# Altium schematic sheet 主板.SchDoc: STM32F407 &
size 711 x 474 mm; Revision: V1.0
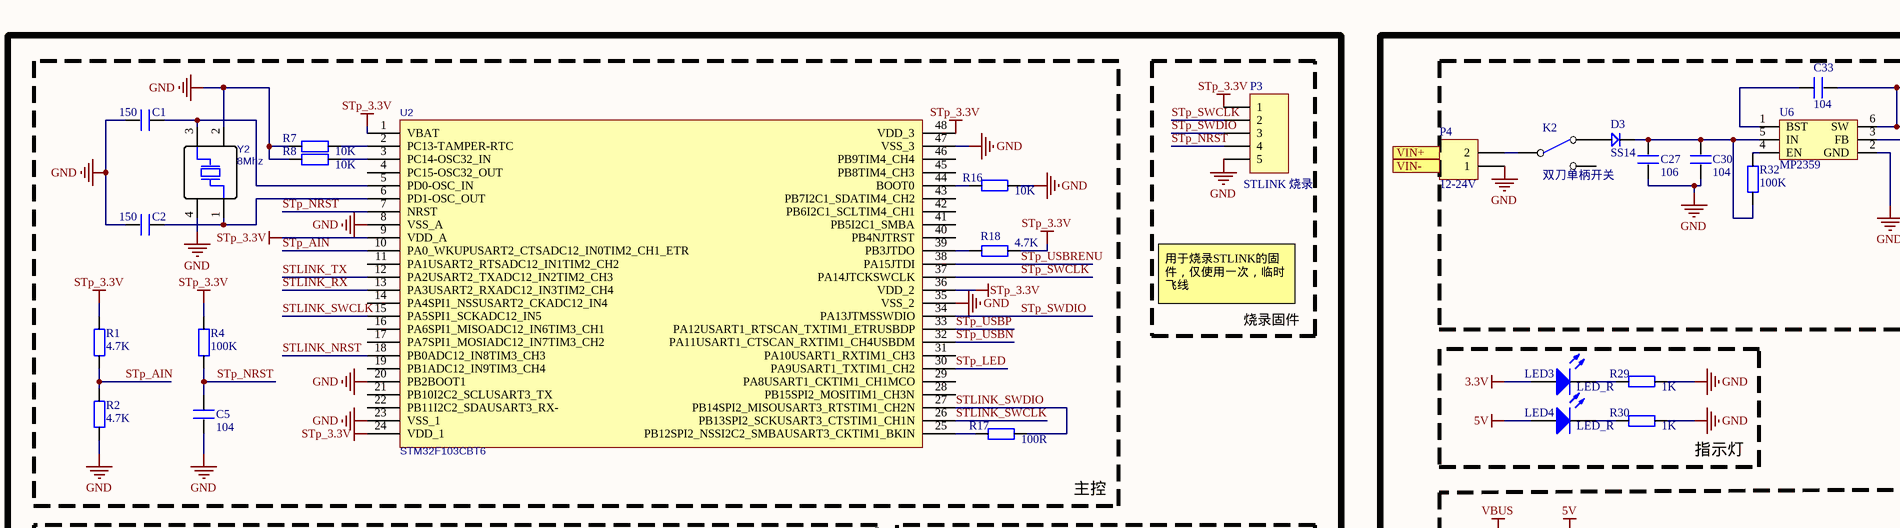
[diagram p0: 主板.SchDoc, top left]
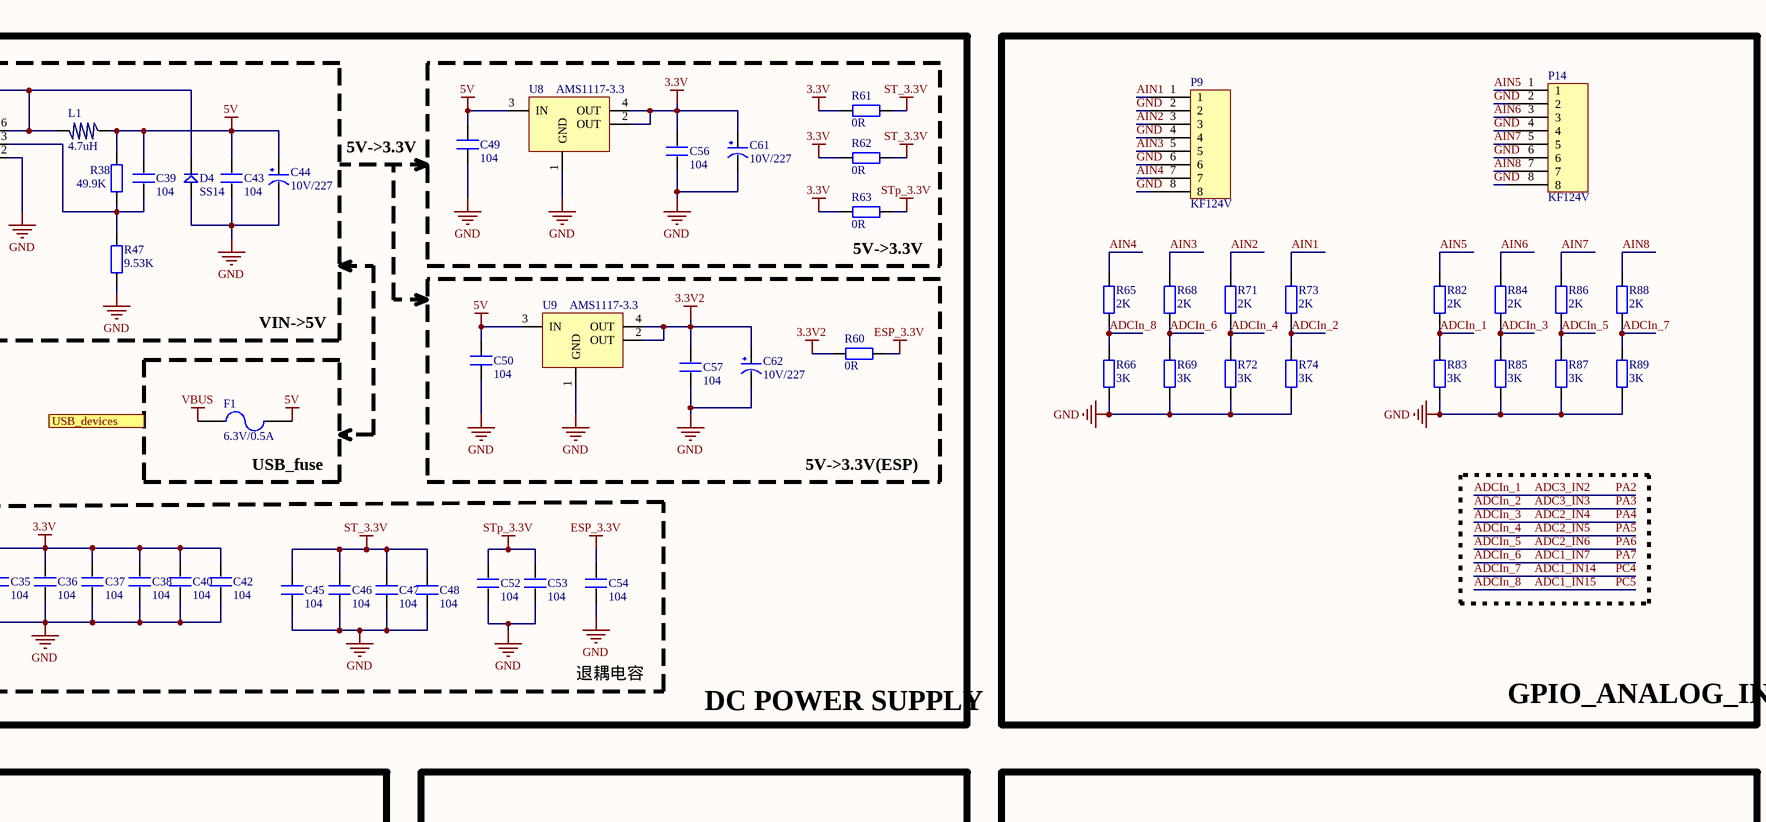
[diagram p1: 主板.SchDoc, top right]
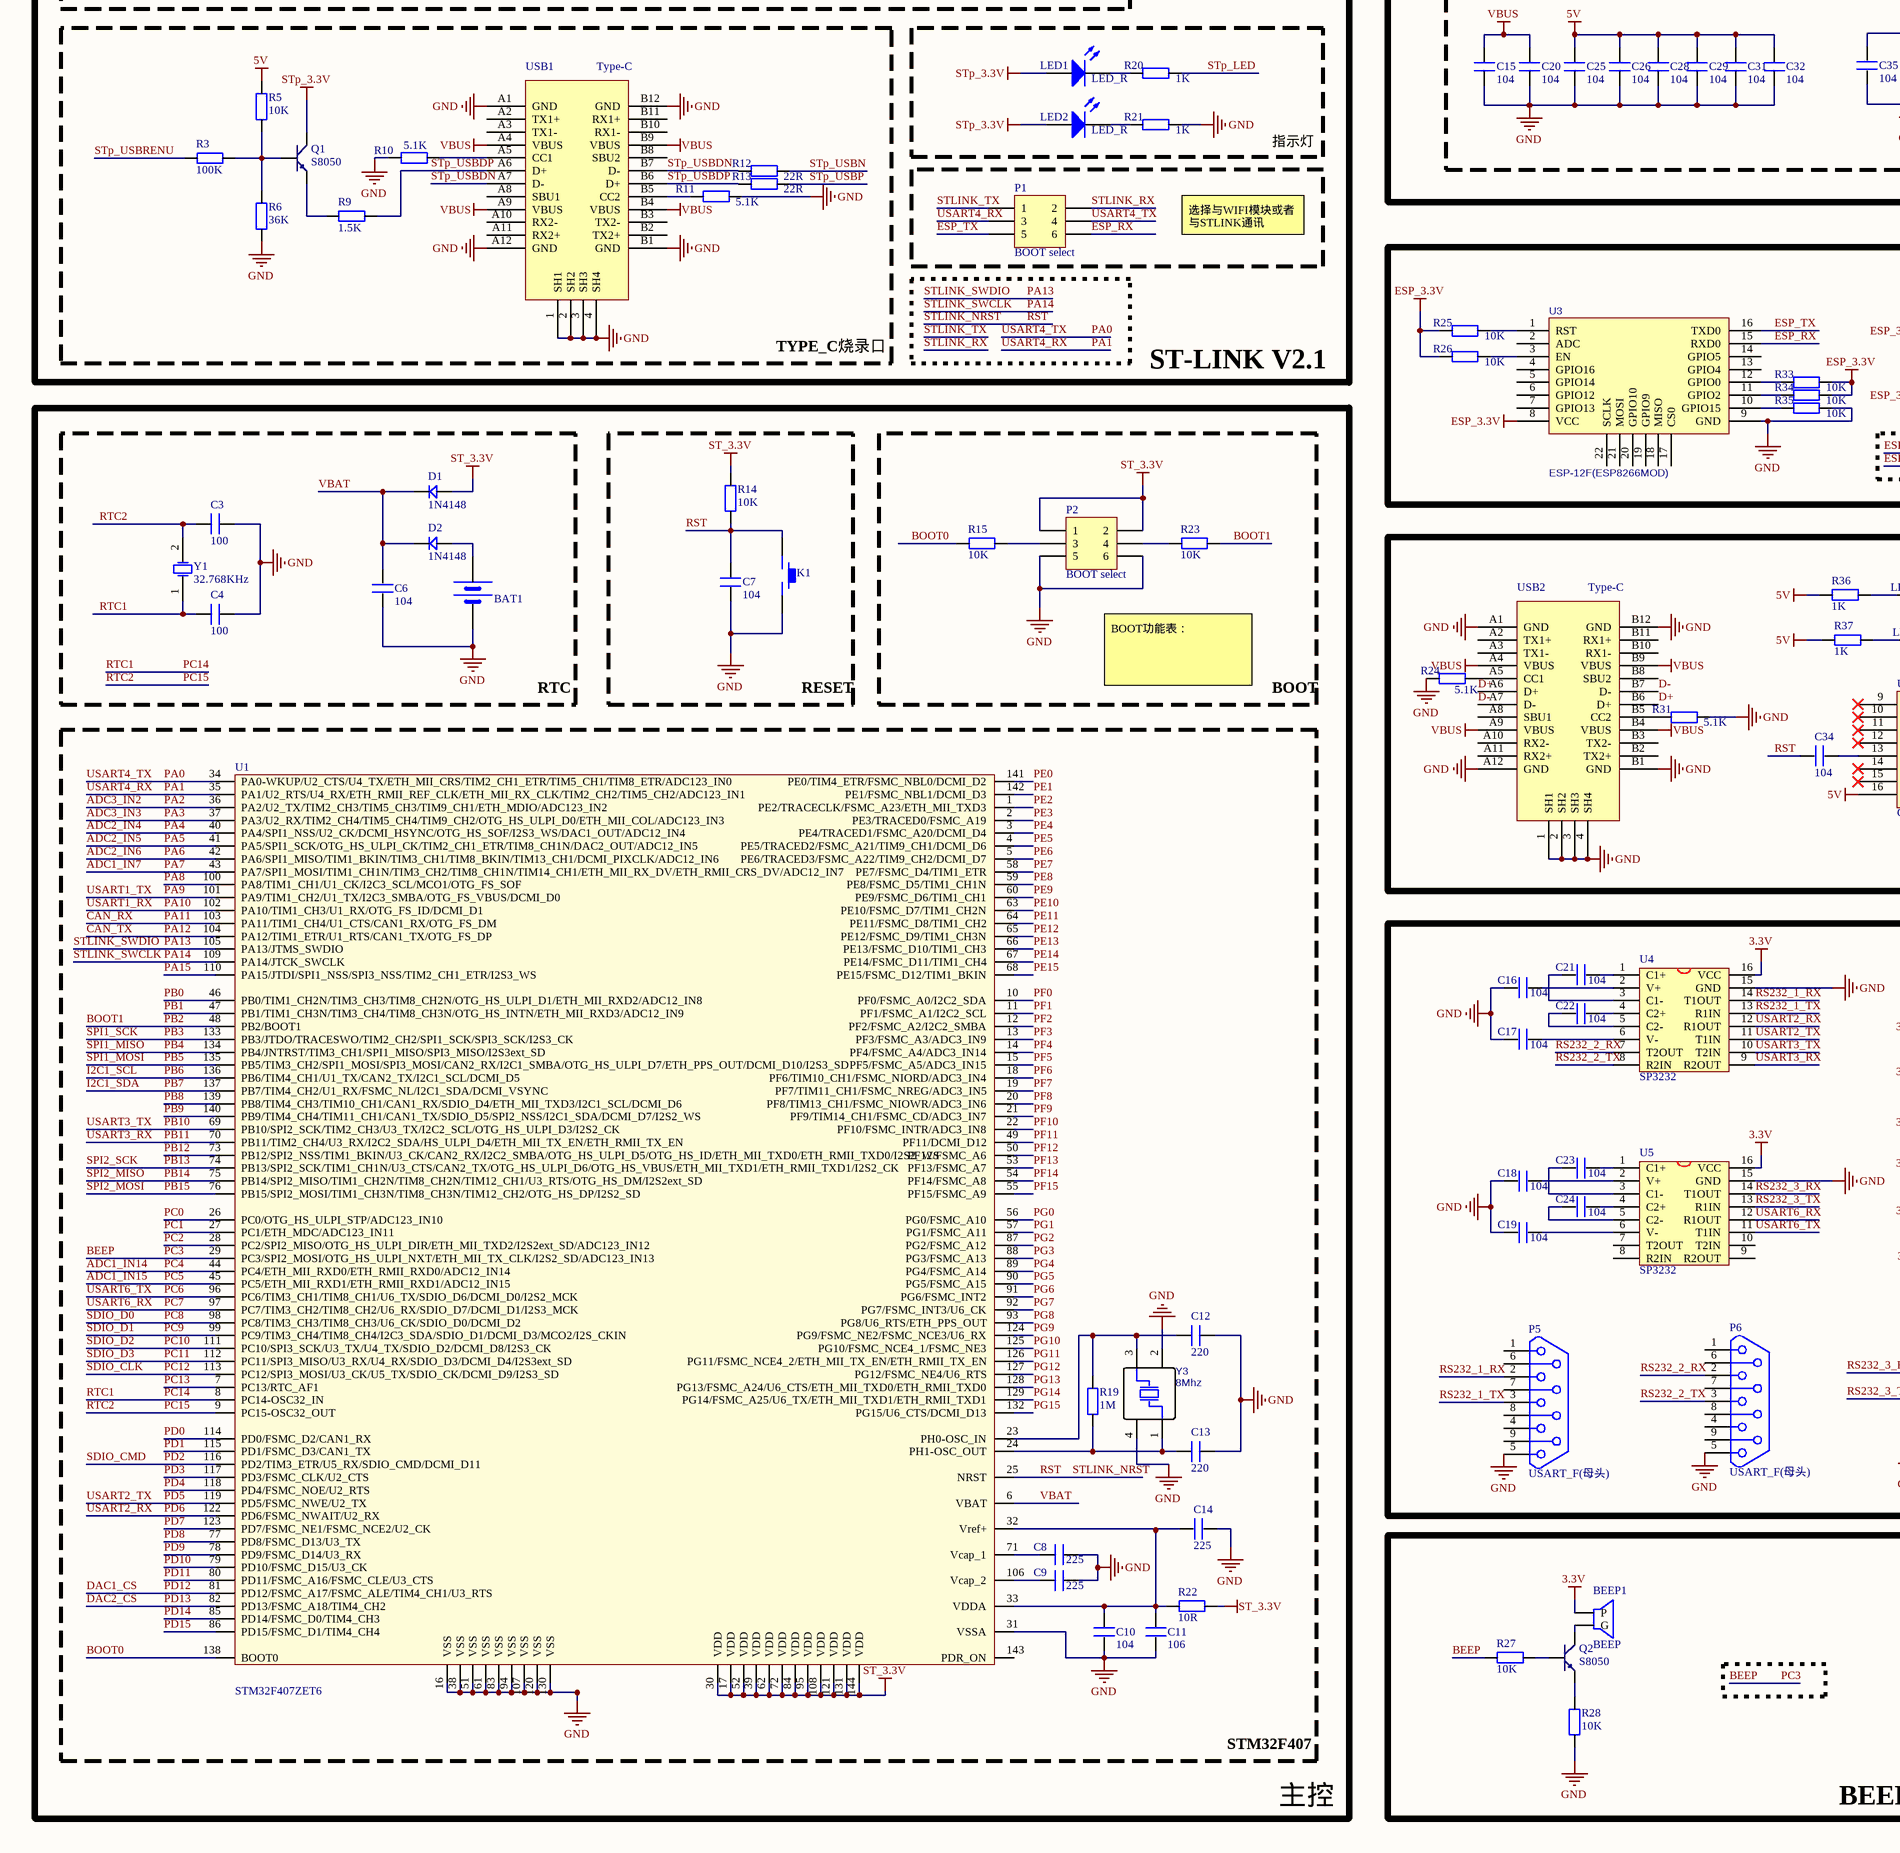
[diagram p2: 主板.SchDoc, bottom left]
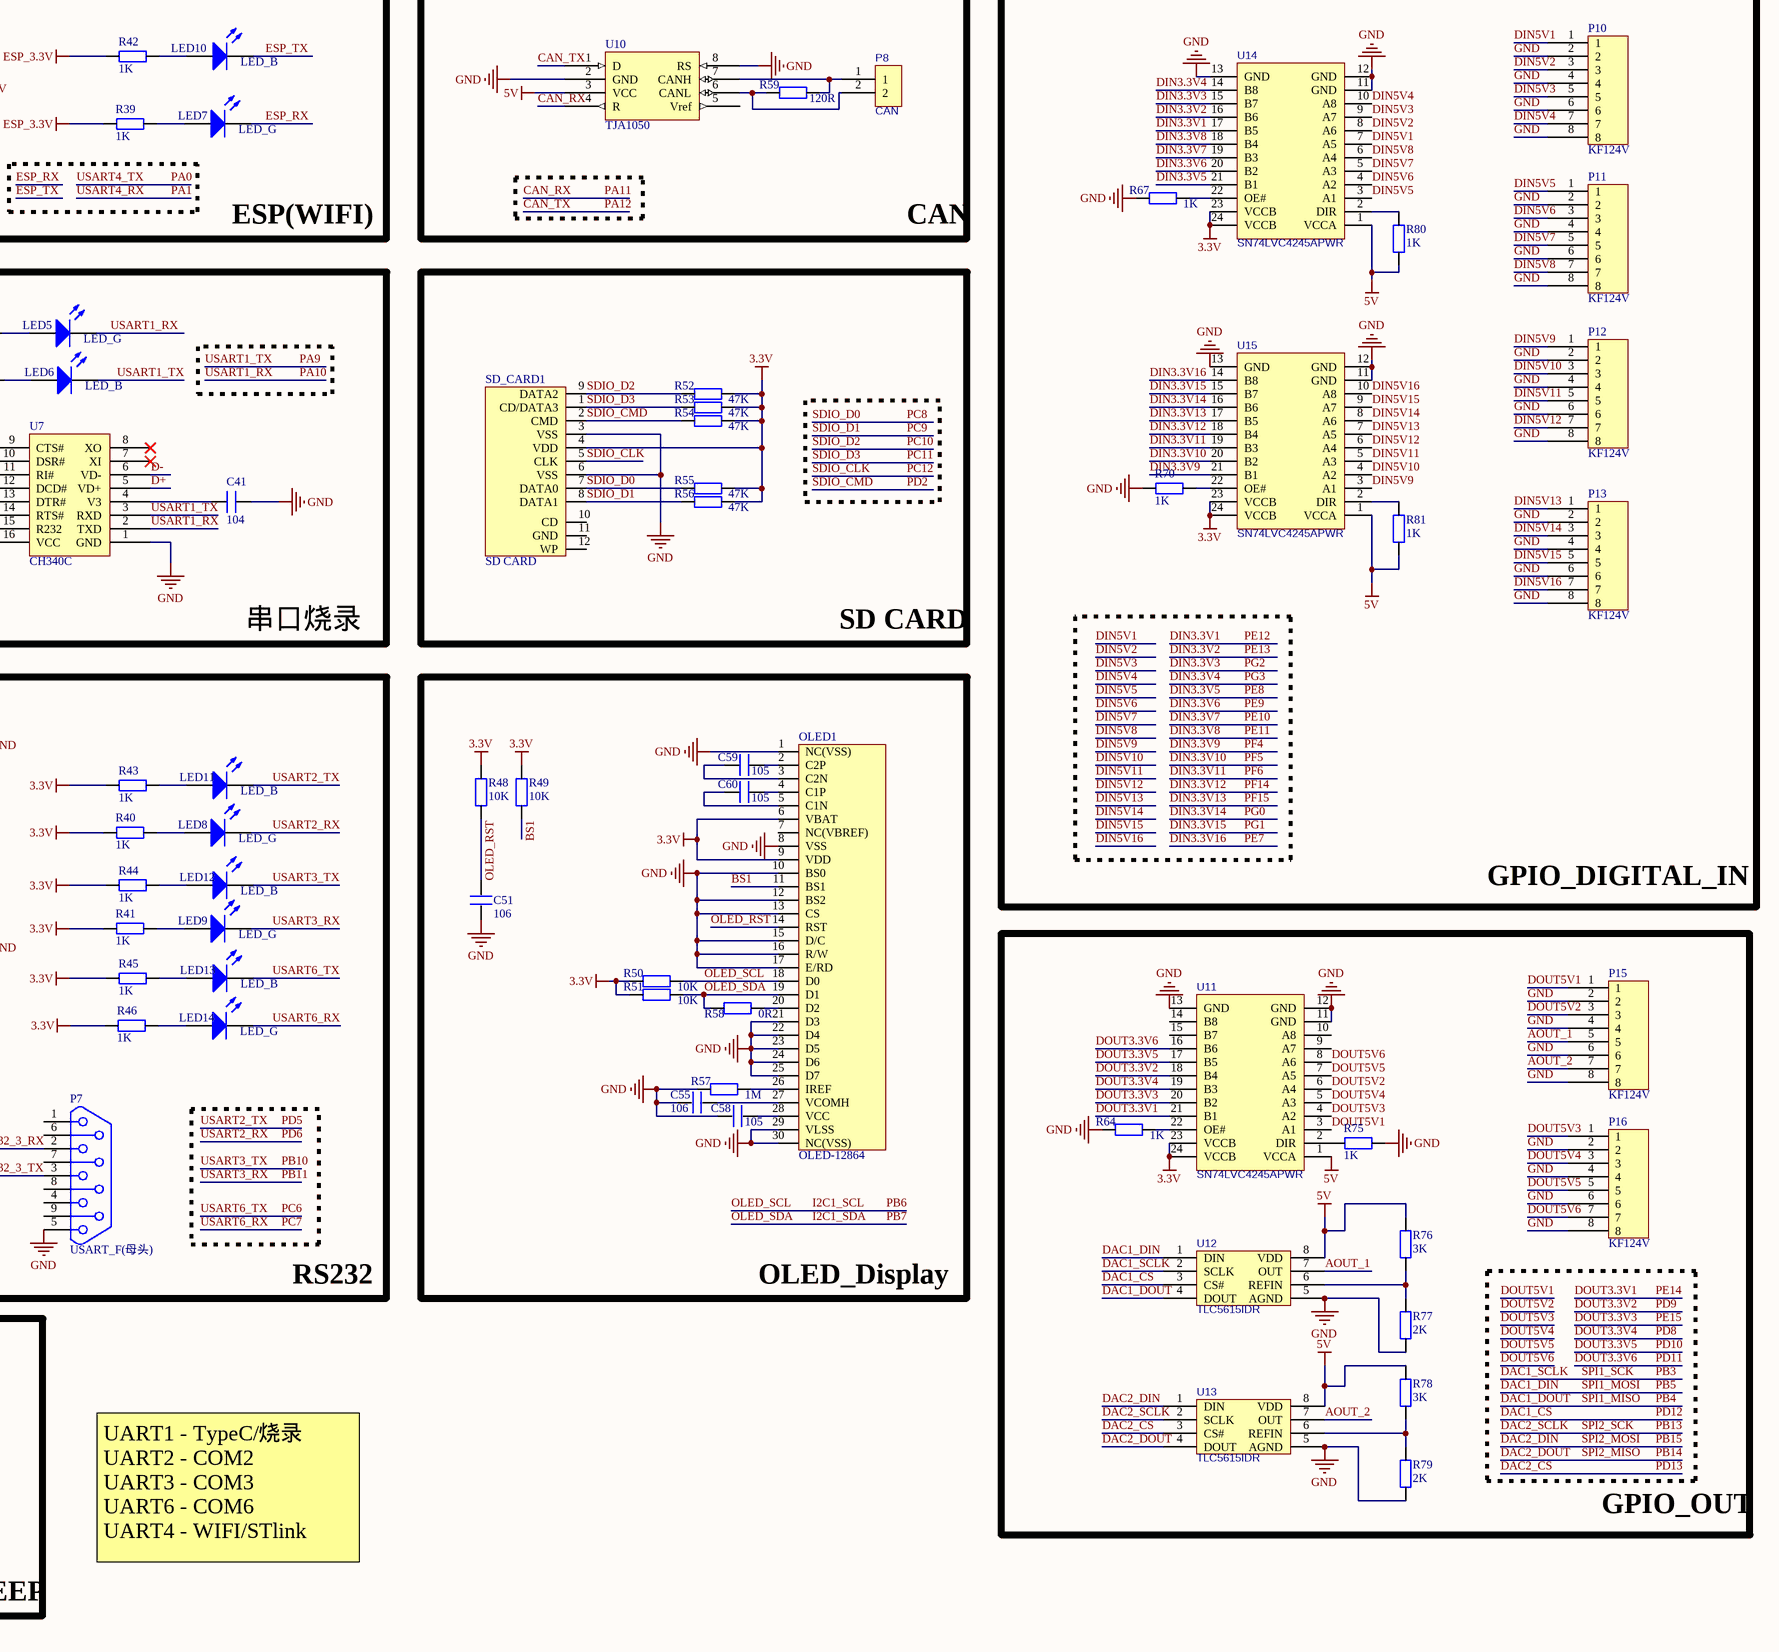
[diagram p3: 主板.SchDoc, bottom right]

## Parts
BAT1  BATT  [CR1220_B]  (value not drawn)
BEEP1  BEEP  [BEEP 5x9x5.5]
C1  150  [C 0805_L]
C2  150  [C 0805_L]
C3  100  [C 0805_L]
C4  100  [C 0805_L]
C5  104  [C 0805_L]
C6  104  [C 0805_L]
C7  104  [C 0805_L]
C8  225  [C 0805_L]
C9  225  [C 0805_L]
C10  104  [C 0805_L]
C11  106  [C 0805_L]
C12  220  [C 0805_L]
C13  220  [C 0805_L]
C14  225  [C 0805_L]
C15  104  [C 0805_L]
C16  104  [C 0805_L]
C17  104  [C 0805_L]
C18  104  [C 0805_L]
C19  104  [C 0805_L]
C20  104  [C 0805_L]
C21  104  [C 0805_L]
C22  104  [C 0805_L]
C23  104  [C 0805_L]
C24  104  [C 0805_L]
C25  104  [C 0805_L]
C26  104  [C 0805_L]
C27  106  [C 1206_L]
C28  104  [C 0805_L]
C29  104  [C 0805_L]
C30  104  [C 0805_L]
C31  104  [C 0805_L]
C32  104  [C 0805_L]
C33  104  [C 0805_L]
C34  104  [C 0805_L]
C35  104  [C 0805_L]
C36  104  [C 0805_L]
C37  104  [C 0805_L]
C38  104  [C 0805_L]
C39  104  [C 0805_L]
C40  104  [C 0805_L]
C41  104  [C 0805_L]
C42  104  [C 0805_L]
C43  104  [C 0805_L]
C44  10V/227  [CM D(6.3*7.7)]
C45  104  [C 0805_L]
C46  104  [C 0805_L]
C47  104  [C 0805_L]
C48  104  [C 0805_L]
C49  104  [C 0805_L]
C50  104  [C 0805_L]
C51  106  [C 0805_L]
C52  104  [C 0805_L]
C53  104  [C 0805_L]
C54  104  [C 0805_L]
C55  106  [C 0805_L]
C56  104  [C 0805_L]
C57  104  [C 0805_L]
C58  105  [C 0805_L]
C59  105  [C 0805_L]
C60  105  [C 0805_L]
C61  10V/227  [CM D(6.3*7.7)]
C62  10V/227  [CM D(6.3*7.7)]
D1  1N4148  [MINI_MELF (LL34)]
D2  1N4148  [MINI_MELF (LL34)]
D3  SS14  [SMA]
D4  SS14  [SMA]
F1  6.3V/0.5A  [C 0805_L]
K1  KEY_M  [TSW SMD-3*6*2.5]  (value not drawn)
K2  双刀单柄开关  [SS-12D10]
L1  4.7uH  [CDRH74]
LED1  LED_R  [LED 0805R]
LED2  LED_R  [LED 0805R]
LED3  LED_R  [LED 0805R]
LED4  LED_R  [LED 0805R]
LED5  LED_G  [LED 0805G]
LED6  LED_B  [LED 0805B]
LED7  LED_G  [LED 0805G]
LED8  LED_G  [LED 0805G]
LED9  LED_G  [LED 0805G]
LED10  LED_B  [LED 0805B]
LED11  LED_B  [LED 0805B]
LED12  LED_B  [LED 0805B]
LED13  LED_B  [LED 0805B]
LED14  LED_G  [LED 0805G]
OLED1  OLED-12864  [OLED-12864-1.3-TOP]
P1  BOOT select  [HDR2.54-LI-2x3P]
P2  BOOT select  [HDR2.54-LI-2x3P]
P3  STLINK 烧录  [ISP5]
P4  12-24V  [KF128-5.08-2P]
P5  USART_F(母头)  [DB9/S_A]
P6  USART_F(母头)  [DB9/S_A]
P7  USART_F(母头)  [DB9/S_A]
P8  CAN  [KF142V-5.08-2P]
P9  KF124V  [KF142V-5.08-8P]
P10  KF124V  [KF142V-5.08-8P]
P11  KF124V  [KF142V-5.08-8P]
P12  KF124V  [KF142V-5.08-8P]
P13  KF124V  [KF142V-5.08-8P]
P14  KF124V  [KF142V-5.08-8P]
P15  KF124V  [KF142V-5.08-8P]
P16  KF124V  [KF142V-5.08-8P]
Q1  S8050  [SOT23-3L]
Q2  S8050  [SOT23-3L]
R1  4.7K  [R 0805_L]
R2  4.7K  [R 0805_L]
R3  100K  [R 0805_L]
R4  100K  [R 0805_L]
R5  10K  [R 0805_L]
R6  36K  [R 0805_L]
R7  10K  [R 0805_L]
R8  10K  [R 0805_L]
R9  1.5K  [R 0805_L]
R10  5.1K  [R 0805_L]
R11  5.1K  [R 0805_L]
R12  22R  [R 0805_L]
R13  22R  [R 0805_L]
R14  10K  [R 0805_L]
R15  10K  [R 0805_L]
R16  10K  [R 0805_L]
R17  100R  [R 0805_L]
R18  4.7K  [R 0805_L]
R19  1M  [R 0805_L]
R20  1K  [R 0805_L]
R21  1K  [R 0805_L]
R22  10R  [R 0805_L]
R23  10K  [R 0805_L]
R24  5.1K  [R 0805_L]
R25  10K  [R 0805_L]
R26  10K  [R 0805_L]
R27  10K  [R 0805_L]
R28  10K  [R 0805_L]
R29  1K  [R 0805_L]
R30  1K  [R 0805_L]
R31  5.1K  [R 0805_L]
R32  100K  [R 0805_L]
R33  10K  [R 0805_L]
R34  10K  [R 0805_L]
R35  10K  [R 0805_L]
R36  1K  [R 0805_L]
R37  1K  [R 0805_L]
R38  49.9K  [R 0805_L]
R39  1K  [R 0805_L]
R40  1K  [R 0805_L]
R41  1K  [R 0805_L]
R42  1K  [R 0805_L]
R43  1K  [R 0805_L]
R44  1K  [R 0805_L]
R45  1K  [R 0805_L]
R46  1K  [R 0805_L]
R47  9.53K  [R 0805_L]
R48  10K  [R 0805_L]
R49  10K  [R 0805_L]
R50  10K  [R 0805_L]
R51  10K  [R 0805_L]
R52  47K  [R 0805_L]
R53  47K  [R 0805_L]
R54  47K  [R 0805_L]
R55  47K  [R 0805_L]
R56  47K  [R 0805_L]
R57  1M  [R 0805_L]
R58  0R  [R 0805_L]
R59  120R  [R 0805_L]
R60  0R  [R 0805_L]
R61  0R  [R 0805_L]
R62  0R  [R 0805_L]
R63  0R  [R 0805_L]
R64  1K  [R 0805_L]
R65  2K  [R 0805_L]
R66  3K  [R 0805_L]
R67  1K  [R 0805_L]
R68  2K  [R 0805_L]
R69  3K  [R 0805_L]
R70  1K  [R 0805_L]
R71  2K  [R 0805_L]
R72  3K  [R 0805_L]
R73  2K  [R 0805_L]
R74  3K  [R 0805_L]
R75  1K  [R 0805_L]
R76  3K  [R 0805_L]
R77  2K  [R 0805_L]
R78  3K  [R 0805_L]
R79  2K  [R 0805_L]
R80  1K  [R 0805_L]
R81  1K  [R 0805_L]
R82  2K  [R 0805_L]
R83  3K  [R 0805_L]
R84  2K  [R 0805_L]
R85  3K  [R 0805_L]
R86  2K  [R 0805_L]
R87  3K  [R 0805_L]
R88  2K  [R 0805_L]
R89  3K  [R 0805_L]
SD_CARD1  SD CARD  [SD-SMD]
U1  STM32F407ZET6  [LQFP144 20X20_L]
U2  STM32F103CBT6  [TQFP48 7x7_L]
U3  ESP-12F(ESP8266MOD)  [ESP32]
U4  SP3232  [SOP16_L]
U5  SP3232  [SOP16_L]
U6  MP2359  [SOT23-6L]
U7  CH340C  [SOP16_L]
U8  AMS1117-3.3  [SOT223_L]
U9  AMS1117-3.3  [SOT223_L]
U10  TJA1050  [SOIC-8]
U11  SN74LVC4245APWR  [TSSOP24_L]
U12  TLC5615IDR  [SOIC-8]
U13  TLC5615IDR  [SOIC-8]
U14  SN74LVC4245APWR  [TSSOP24_L]
U15  SN74LVC4245APWR  [TSSOP24_L]
USB1  Type-C  [USBTypeC-16P]
USB2  Type-C  [USBTypeC-16P]
Y1  32.768KHz  [OSC 3215-2P]
Y2  8Mhz  [OSC 5032-4P]
Y3  8Mhz  [OSC 5032-4P]

## Blocks framed on the sheet
ST-LINK V2.1: P1
GPIO_ANALOG_IN: P9 P14 R65 R66 R68 R69 R71-R74 R82-R89
主控: C1 C2 C5 R1 R2 R4 R7 R8 R16-R18 U2 Y2
烧录固件: P3
VIN->5V: C27 C30 C33 C39 C43 C44 D3 D4 K2 L1 P4 R32 R38 R47 U6
5V->3.3V: C49 C56 C61 R61-R63 U8
5V->3.3V(ESP): C50 C57 C62 R60 U9
指示灯: LED3 LED4 R29 R30
USB_fuse: F1
退耦电容: C15 C20 C25 C26 C28 C29 C31 C32 C35-C38 C40 C42 C45-C48 C52-C54
TYPE_C烧录口: Q1 R3 R5 R6 R9-R13 USB1
指示灯: LED1 LED2 R20 R21
ESP(WIFI): LED7 LED10 R25 R26 R33-R35 R39 R42 U3
CAN: P8 R59 U10
GPIO_DIGITAL_IN: P10-P13 R67 R70 R80 R81 U14 U15
RTC: BAT1 C3 C4 C6 D1 D2 Y1
RESET: C7 K1 R14
BOOT: P2 R15 R23
串口烧录: C34 C41 LED5 LED6 R24 R31 R36 R37 U7 USB2
SD CARD: R52-R56 SD_CARD1
STM32F407: C8-C14 R19 R22 U1 Y3
RS232: C16-C19 C21-C24 LED8 LED9 LED11-LED14 P5-P7 R40 R41 R43-R46 U4 U5
OLED_Display: C51 C55 C58-C60 OLED1 R48-R51 R57 R58
GPIO_OUT: P15 P16 R64 R75-R79 U11-U13
BEEP: BEEP1 Q2 R27 R28

## Ports
USB_devices, VIN+, VIN-

## Nets
3.3V: BEEP1.1(P) C35.2 C36.2 C37.2 C38.2 C40.2 C42.2 C56.2 C61.1(VCC) LED3.1(A) OLED1.6(VBAT) OLED1.9(VDD) R40.2 R41.2 R43.2 R44.2 R45.2 R46.2 R48.2 R49.1 R50.1 R51.1 R52.2 R53.2 R54.2 R55.2 R56.2 R61.1 R62.1 R63.1 SD_CARD1.4(VDD) U4.16(VCC) U5.16(VCC) U8.2(OUT) U8.4(OUT) U11.23(VCCB) U11.24(VCCB) U14.23(VCCB) U14.24(VCCB) U15.23(VCCB) U15.24(VCCB)
3.3V2: C57.2 C62.1(VCC) R60.1 U9.2(OUT) U9.4(OUT)
5V: C25.2 C26.2 C28.2 C29.2 C31.2 C32.2 C39.2 C43.2 C44.1(VCC) C49.2 C50.2 F1.2 L1.1 LED4.1(A) R5.1 R36.2 R37.2 R38.2 R76.2 R78.2 R80.1 R81.1 U7.16(VCC) U8.3(IN) U9.3(IN) U10.3(VCC) U11.1(VCCA) U12.8(VDD) U13.8(VDD) U14.1(VCCA) U15.1(VCCA)
ESP_3.3V: C54.2 R25.2 R26.2 R33.2 R34.2 R39.2 R42.2 R60.2 U3.8(VCC)
GND: BAT1.2(GND) C1.1 C2.2 C3.2 C4.1 C5.1 C6.2 C7.2 C8.1 C9.1 C10.1 C11.1 C12.2 C13.1 C14.1 C15.1 C16.1 C17.1 C18.1 C19.1 C20.1 C25.1 C26.1 C27.1 C28.1 C29.1 C30.1 C31.1 C32.1 C35.1 C36.1 C37.1 C38.1 C40.1 C41.2 C42.1 C43.1 C44.2(GND) C45.1 C46.1 C47.1 C48.1 C49.1 C50.1 C51.2 C52.1 C53.1 C54.1 C55.1 C56.1 C57.1 C58.1 C61.2(GND) C62.2(GND) D4.1 K1.2 OLED1.1(NC(VSS)) OLED1.8(VSS) OLED1.10(BS0) OLED1.12(BS2) OLED1.13(CS) OLED1.15(D/C) OLED1.16(R/W) OLED1.17(E/RD) OLED1.21(D3) OLED1.22(D4) OLED1.23(D5) OLED1.24(D6) OLED1.25(D7) OLED1.29(VLSS) OLED1.30(NC(VSS)) P2.5 P2.6 P3.5 P4.1 P5.5 P6.5 P7.5 P9.2 P9.4 P9.6 P9.8 P10.2 P10.4 P10.6 P10.8 P11.2 P11.4 P11.6 P11.8 P12.2 P12.4 P12.6 P12.8 P13.2 P13.4 P13.6 P13.8 P14.2 P14.4 P14.6 P14.8 P15.2 P15.4 P15.6 P15.8 P16.2 P16.4 P16.6 P16.8 R2.1 R6.2 R7.1 R8.1 R10.1 R11.2 R16.2 R21.2 R24.1 R28.2 R29.2 R30.2 R31.2 R35.2 R47.1 R57.1 R64.1 R66.1 R67.1 R69.1 R70.2 R72.1 R74.1 R75.2 R77.1 R79.1 R83.1 R85.1 R87.1 R89.1 SD_CARD1.3(VSS) SD_CARD1.6(VSS) U1.16(VSS) U1.31(VSSA) U1.38(VSS) U1.51(VSS) U1.61(VSS) U1.83(VSS) U1.94(VSS) U1.107(VSS) U1.120(VSS) U1.130(VSS) U2.8(VSS_A) U2.20(PB2BOOT1) U2.23(VSS_1) U2.35(VSS_2) U2.47(VSS_3) U3.9(GND) U4.15(GND) U5.15(GND) U6.2(GND) U7.1(GND) U8.1(GND) U9.1(GND) U10.2(GND) U10.8(RS) U11.11(GND) U11.12(GND) U11.13(GND) U12.5(AGND) U13.5(AGND) U14.11(GND) U14.12(GND) U14.13(GND) U15.11(GND) U15.12(GND) U15.13(GND) USB1.1(SH1) USB1.2(SH2) USB1.3(SH3) USB1.4(SH4) USB1.A1(GND) USB1.A12(GND) USB1.B1(GND) USB1.B12(GND) USB2.1(SH1) USB2.2(SH2) USB2.3(SH3) USB2.4(SH4) USB2.A1(GND) USB2.A12(GND) USB2.B1(GND) USB2.B12(GND) Y2.2(GND) Y2.4(GND) Y3.2(GND) Y3.4(GND)
ST_3.3V: C45.2 C46.2 C47.2 C48.2 D1.1 P2.1 P2.2 R14.1 R22.2 R61.2 R62.2 U1.17(VDD) U1.30(VDD) U1.39(VDD) U1.52(VDD) U1.62(VDD) U1.72(VDD) U1.84(VDD) U1.95(VDD) U1.108(VDD) U1.121(VDD) U1.131(VDD) U1.144(VDD)
STp_3.3V: C52.2 C53.2 LED1.1(A) LED2.1(A) P3.1 Q1.3(C) R1.2 R4.2 R18.1 R63.2 U2.1(VBAT) U2.9(VDD_A) U2.24(VDD_1) U2.36(VDD_2) U2.48(VDD_3)
VBUS: C15.2 C20.2 F1.1 USB1.A4(VBUS) USB1.A9(VBUS) USB1.B4(VBUS) USB1.B9(VBUS) USB2.A4(VBUS) USB2.A9(VBUS) USB2.B4(VBUS) USB2.B9(VBUS)
ADC1_IN7: R68.1 R69.2 U1.43(PA7/SPI1_MOSI/TIM1_CH1N/TIM3_CH2/TIM8_CH1N/TIM14_CH1/ETH_MII_RX_DV/ETH_RMII_CRS_DV/ADC12_IN7)  [also labelled ADCIn_6, PA7]
ADC1_IN14: R88.1 R89.2 U1.44(PC4/ETH_MII_RXD0/ETH_RMII_RXD0/ADC12_IN14)  [also labelled ADCIn_7, PC4]
ADC1_IN15: R65.1 R66.2 U1.45(PC5/ETH_MII_RXD1/ETH_RMII_RXD1/ADC12_IN15)  [also labelled ADCIn_8, PC5]
ADC2_IN4: R84.1 R85.2 U1.40(PA4/SPI1_NSS/U2_CK/DCMI_HSYNC/OTG_HS_SOF/I2S3_WS/DAC1_OUT/ADC12_IN4)  [also labelled ADCIn_3, PA4]
ADC2_IN5: R71.1 R72.2 U1.41(PA5/SPI1_SCK/OTG_HS_ULPI_CK/TIM2_CH1_ETR/TIM8_CH1N/DAC2_OUT/ADC12_IN5)  [also labelled ADCIn_4, PA5]
ADC2_IN6: R86.1 R87.2 U1.42(PA6/SPI1_MISO/TIM1_BKIN/TIM3_CH1/TIM8_BKIN/TIM13_CH1/DCMI_PIXCLK/ADC12_IN6)  [also labelled ADCIn_5, PA6]
ADC3_IN2: R82.1 R83.2 U1.36(PA2/U2_TX/TIM2_CH3/TIM5_CH3/TIM9_CH1/ETH_MDIO/ADC123_IN2)  [also labelled ADCIn_1, PA2]
ADC3_IN3: R73.1 R74.2 U1.37(PA3/U2_RX/TIM2_CH4/TIM5_CH4/TIM9_CH2/OTG_HS_ULPI_D0/ETH_MII_COL/ADC123_IN3)  [also labelled ADCIn_2, PA3]
AIN1: P9.1 R73.2
AIN2: P9.3 R71.2
AIN3: P9.5 R68.2
AIN4: P9.7 R65.2
AIN5: P14.1 R82.2
AIN6: P14.3 R84.2
AIN7: P14.5 R86.2
AIN8: P14.7 R88.2
AOUT_1: P15.5 U12.7(OUT)
AOUT_2: P15.7 U13.7(OUT)
BEEP: R27.2 U1.29(PC3/SPI2_MOSI/OTG_HS_ULPI_NXT/ETH_MII_TX_CLK/I2S2_SD/ADC123_IN13)  [also labelled PC3]
BOOT0: R15.1 U1.138(BOOT0)
BOOT1: R23.2 U1.48(PB2/BOOT1)  [also labelled PB2]
BS1: OLED1.11(BS1) R49.2
CAN_RX: U1.103(PA11/TIM1_CH4/U1_CTS/CAN1_RX/OTG_FS_DM) U10.4(R)  [also labelled PA11]
CAN_TX: U1.104(PA12/TIM1_ETR/U1_RTS/CAN1_TX/OTG_FS_DP) U10.1(D)  [also labelled PA12]
D+: U7.5(VD+) USB2.A6(D+) USB2.B6(D+)
D-: U7.6(VD-) USB2.A7(D-) USB2.B7(D-)
DAC1_CS: U1.81(PD12/FSMC_A17/FSMC_ALE/TIM4_CH1/U3_RTS) U12.3(CS#)  [also labelled PD12]
DAC1_DIN: U1.135(PB5/TIM3_CH2/SPI1_MOSI/SPI3_MOSI/CAN2_RX/I2C1_SMBA/OTG_HS_ULPI_D7/ETH_PPS_OUT/DCMI_D10/I2S3_SD) U12.1(DIN)  [also labelled PB5, SPI1_MOSI]
DAC1_DOUT: U1.134(PB4/JNTRST/TIM3_CH1/SPI1_MISO/SPI3_MISO/I2S3ext_SD) U12.4(DOUT)  [also labelled PB4, SPI1_MISO]
DAC1_SCLK: U1.133(PB3/JTDO/TRACESWO/TIM2_CH2/SPI1_SCK/SPI3_SCK/I2S3_CK) U12.2(SCLK)  [also labelled PB3, SPI1_SCK]
DAC2_CS: U1.82(PD13/FSMC_A18/TIM4_CH2) U13.3(CS#)  [also labelled PD13]
DAC2_DIN: U1.76(PB15/SPI2_MOSI/TIM1_CH3N/TIM8_CH3N/TIM12_CH2/OTG_HS_DP/I2S2_SD) U13.1(DIN)  [also labelled PB15, SPI2_MOSI]
DAC2_DOUT: U1.75(PB14/SPI2_MISO/TIM1_CH2N/TIM8_CH2N/TIM12_CH1/U3_RTS/OTG_HS_DM/I2S2ext_SD) U13.4(DOUT)  [also labelled PB14, SPI2_MISO]
DAC2_SCLK: U1.74(PB13/SPI2_SCK/TIM1_CH1N/U3_CTS/CAN2_TX/OTG_HS_ULPI_D6/OTG_HS_VBUS/ETH_MII_TXD1/ETH_RMII_TXD1/I2S2_CK) U13.2(SCLK)  [also labelled PB13, SPI2_SCK]
DIN3.3V1: U1.65(PE12/FSMC_D9/TIM1_CH3N) U14.17(B5)  [also labelled PE12]
DIN3.3V2: U1.66(PE13/FSMC_D10/TIM1_CH3) U14.16(B6)  [also labelled PE13]
DIN3.3V3: U1.87(PG2/FSMC_A12) U14.15(B7)  [also labelled PG2]
DIN3.3V4: U1.88(PG3/FSMC_A13) U14.14(B8)  [also labelled PG3]
DIN3.3V5: U1.59(PE8/FSMC_D5/TIM1_CH1N) U14.21(B1)  [also labelled PE8]
DIN3.3V6: U1.60(PE9/FSMC_D6/TIM1_CH1) U14.20(B2)  [also labelled PE9]
DIN3.3V7: U1.63(PE10/FSMC_D7/TIM1_CH2N) U14.19(B3)  [also labelled PE10]
DIN3.3V8: U1.64(PE11/FSMC_D8/TIM1_CH2) U14.18(B4)  [also labelled PE11]
DIN3.3V9: U1.14(PF4/FSMC_A4/ADC3_IN14) U15.21(B1)  [also labelled PF4]
DIN3.3V10: U1.15(PF5/FSMC_A5/ADC3_IN15) U15.20(B2)  [also labelled PF5]
DIN3.3V11: U1.18(PF6/TIM10_CH1/FSMC_NIORD/ADC3_IN4) U15.19(B3)  [also labelled PF6]
DIN3.3V12: U1.54(PF14/FSMC_A8) U15.18(B4)  [also labelled PF14]
DIN3.3V13: U1.55(PF15/FSMC_A9) U15.17(B5)  [also labelled PF15]
DIN3.3V14: U1.56(PG0/FSMC_A10) U15.16(B6)  [also labelled PG0]
DIN3.3V15: U1.57(PG1/FSMC_A11) U15.15(B7)  [also labelled PG1]
DIN3.3V16: U1.58(PE7/FSMC_D4/TIM1_ETR) U15.14(B8)  [also labelled PE7]
DIN5V1: P10.1 U14.7(A5)
DIN5V2: P10.3 U14.8(A6)
DIN5V3: P10.5 U14.9(A7)
DIN5V4: P10.7 U14.10(A8)
DIN5V5: P11.1 U14.3(A1)
DIN5V6: P11.3 U14.4(A2)
DIN5V7: P11.5 U14.5(A3)
DIN5V8: P11.7 U14.6(A4)
DIN5V9: P12.1 U15.3(A1)
DIN5V10: P12.3 U15.4(A2)
DIN5V11: P12.5 U15.5(A3)
DIN5V12: P12.7 U15.6(A4)
DIN5V13: P13.1 U15.7(A5)
DIN5V14: P13.3 U15.8(A6)
DIN5V15: P13.5 U15.9(A7)
DIN5V16: P13.7 U15.10(A8)
DOUT3.3V1: U1.67(PE14/FSMC_D11/TIM1_CH4) U11.21(B1)  [also labelled PE14]
DOUT3.3V2: U1.78(PD9/FSMC_D14/U3_RX) U11.18(B4)  [also labelled PD9]
DOUT3.3V3: U1.68(PE15/FSMC_D12/TIM1_BKIN) U11.20(B2)  [also labelled PE15]
DOUT3.3V4: U1.77(PD8/FSMC_D13/U3_TX) U11.19(B3)  [also labelled PD8]
DOUT3.3V5: U1.79(PD10/FSMC_D15/U3_CK) U11.17(B5)  [also labelled PD10]
DOUT3.3V6: U1.80(PD11/FSMC_A16/FSMC_CLE/U3_CTS) U11.16(B6)  [also labelled PD11]
DOUT5V1: P15.1 U11.3(A1)
DOUT5V2: P15.3 U11.6(A4)
DOUT5V3: P16.1 U11.4(A2)
DOUT5V4: P16.3 U11.5(A3)
DOUT5V5: P16.5 U11.7(A5)
DOUT5V6: P16.7 U11.8(A6)
ESP_RX: LED7.2(K) P1.6 U3.15(RXD0)
ESP_TX: LED10.2(K) P1.5 U3.16(TXD0)
I2C1_SCL: OLED1.18(D0) R50.2 U1.136(PB6/TIM4_CH1/U1_TX/CAN2_TX/I2C1_SCL/DCMI_D5)  [also labelled OLED_SCL, PB6]
I2C1_SDA: OLED1.19(D1) R51.2 R58.1 U1.137(PB7/TIM4_CH2/U1_RX/FSMC_NL/I2C1_SDA/DCMI_VSYNC)  [also labelled OLED_SDA, PB7]
OLED_RST: C51.1 OLED1.14(RST) R48.1
PA0: P1.4 U1.34(PA0-WKUP/U2_CTS/U4_TX/ETH_MII_CRS/TIM2_CH1_ETR/TIM5_CH1/TIM8_ETR/ADC123_IN0)  [also labelled USART4_TX]
PA1: P1.3 U1.35(PA1/U2_RTS/U4_RX/ETH_RMII_REF_CLK/ETH_MII_RX_CLK/TIM2_CH2/TIM5_CH2/ADC123_IN1)  [also labelled USART4_RX]
PA8: U1.100(PA8/TIM1_CH1/U1_CK/I2C3_SCL/MCO1/OTG_FS_SOF)
PA9: LED6.2(K) U1.101(PA9/TIM1_CH2/U1_TX/I2C3_SMBA/OTG_FS_VBUS/DCMI_D0) U7.3(RXD)  [also labelled USART1_TX]
PA10: LED5.2(K) U1.102(PA10/TIM1_CH3/U1_RX/OTG_FS_ID/DCMI_D1) U7.2(TXD)  [also labelled USART1_RX]
PA13: R17.1 U1.105(PA13/JTMS_SWDIO) U2.27(PB14SPI2_MISOUSART3_RTSTIM1_CH2N)  [also labelled STLINK_SWDIO]
PA14: U1.109(PA14/JTCK_SWCLK) U2.15(PA5SPI1_SCKADC12_IN5) U2.26(PB13SPI2_SCKUSART3_CTSTIM1_CH1N)  [also labelled STLINK_SWCLK]
PA15: U1.110(PA15/JTDI/SPI1_NSS/SPI3_NSS/TIM2_CH1_ETR/I2S3_WS)
PB0: U1.46(PB0/TIM1_CH2N/TIM3_CH3/TIM8_CH2N/OTG_HS_ULPI_D1/ETH_MII_RXD2/ADC12_IN8)
PB1: U1.47(PB1/TIM1_CH3N/TIM3_CH4/TIM8_CH3N/OTG_HS_INTN/ETH_MII_RXD3/ADC12_IN9)
PB8: U1.139(PB8/TIM4_CH3/TIM10_CH1/CAN1_RX/SDIO_D4/ETH_MII_TXD3/I2C1_SCL/DCMI_D6)
PB9: U1.140(PB9/TIM4_CH4/TIM11_CH1/CAN1_TX/SDIO_D5/SPI2_NSS/I2C1_SDA/DCMI_D7/I2S2_WS)
PB10: LED12.2(K) U1.69(PB10/SPI2_SCK/TIM2_CH3/U3_TX/I2C2_SCL/OTG_HS_ULPI_D3/I2S2_CK) U4.10(T2IN)  [also labelled USART3_TX]
PB11: LED9.2(K) U1.70(PB11/TIM2_CH4/U3_RX/I2C2_SDA/HS_ULPI_D4/ETH_MII_TX_EN/ETH_RMII_TX_EN) U4.9(R2OUT)  [also labelled USART3_RX]
PB12: U1.73(PB12/SPI2_NSS/TIM1_BKIN/U3_CK/CAN2_RX/I2C2_SMBA/OTG_HS_ULPI_D5/OTG_HS_ID/ETH_MII_TXD0/ETH_RMII_TXD0/I2S2_WS)
PC0: U1.26(PC0/OTG_HS_ULPI_STP/ADC123_IN10)
PC1: U1.27(PC1/ETH_MDC/ADC123_IN11)
PC2: U1.28(PC2/SPI2_MISO/OTG_HS_ULPI_DIR/ETH_MII_TXD2/I2S2ext_SD/ADC123_IN12)
PC6: LED13.2(K) U1.96(PC6/TIM3_CH1/TIM8_CH1/U6_TX/SDIO_D6/DCMI_D0/I2S2_MCK) U5.11(T1IN)  [also labelled USART6_TX]
PC7: LED14.2(K) U1.97(PC7/TIM3_CH2/TIM8_CH2/U6_RX/SDIO_D7/DCMI_D1/I2S3_MCK) U5.12(R1OUT)  [also labelled USART6_RX]
PC8: R55.1 SD_CARD1.7(DATA0) U1.98(PC8/TIM3_CH3/TIM8_CH3/U6_CK/SDIO_D0/DCMI_D2)  [also labelled SDIO_D0]
PC9: R56.1 SD_CARD1.8(DATA1) U1.99(PC9/TIM3_CH4/TIM8_CH4/I2C3_SDA/SDIO_D1/DCMI_D3/MCO2/I2S_CKIN)  [also labelled SDIO_D1]
PC10: R52.1 SD_CARD1.9(DATA2) U1.111(PC10/SPI3_SCK/U3_TX/U4_TX/SDIO_D2/DCMI_D8/I2S3_CK)  [also labelled SDIO_D2]
PC11: R53.1 SD_CARD1.1(CD/DATA3) U1.112(PC11/SPI3_MISO/U3_RX/U4_RX/SDIO_D3/DCMI_D4/I2S3ext_SD)  [also labelled SDIO_D3]
PC12: SD_CARD1.5(CLK) U1.113(PC12/SPI3_MOSI/U3_CK/U5_TX/SDIO_CK/DCMI_D9/I2S3_SD)  [also labelled SDIO_CLK]
PC13: U1.7(PC13/RTC_AF1)
PC14: C4.2 U1.8(PC14-OSC32_IN) Y1.1(OSC1)  [also labelled RTC1]
PC15: C3.1 U1.9(PC15-OSC32_OUT) Y1.2(OSC2)  [also labelled RTC2]
PD0: U1.114(PD0/FSMC_D2/CAN1_RX)
PD1: U1.115(PD1/FSMC_D3/CAN1_TX)
PD2: R54.1 SD_CARD1.2(CMD) U1.116(PD2/TIM3_ETR/U5_RX/SDIO_CMD/DCMI_D11)  [also labelled SDIO_CMD]
PD3: U1.117(PD3/FSMC_CLK/U2_CTS)
PD4: U1.118(PD4/FSMC_NOE/U2_RTS)
PD5: LED11.2(K) U1.119(PD5/FSMC_NWE/U2_TX) U4.11(T1IN)  [also labelled USART2_TX]
PD6: LED8.2(K) U1.122(PD6/FSMC_NWAIT/U2_RX) U4.12(R1OUT)  [also labelled USART2_RX]
PD7: U1.123(PD7/FSMC_NE1/FSMC_NCE2/U2_CK)
PD14: U1.85(PD14/FSMC_D0/TIM4_CH3)
PD15: U1.86(PD15/FSMC_D1/TIM4_CH4)
PE0: U1.141(PE0/TIM4_ETR/FSMC_NBL0/DCMI_D2)
PE1: U1.142(PE1/FSMC_NBL1/DCMI_D3)
PE2: U1.1(PE2/TRACECLK/FSMC_A23/ETH_MII_TXD3)
PE3: U1.2(PE3/TRACED0/FSMC_A19)
PE4: U1.3(PE4/TRACED1/FSMC_A20/DCMI_D4)
PE5: U1.4(PE5/TRACED2/FSMC_A21/TIM9_CH1/DCMI_D6)
PE6: U1.5(PE6/TRACED3/FSMC_A22/TIM9_CH2/DCMI_D7)
PF0: U1.10(PF0/FSMC_A0/I2C2_SDA)
PF1: U1.11(PF1/FSMC_A1/I2C2_SCL)
PF2: U1.12(PF2/FSMC_A2/I2C2_SMBA)
PF3: U1.13(PF3/FSMC_A3/ADC3_IN9)
PF7: U1.19(PF7/TIM11_CH1/FSMC_NREG/ADC3_IN5)
PF8: U1.20(PF8/TIM13_CH1/FSMC_NIOWR/ADC3_IN6)
PF9: U1.21(PF9/TIM14_CH1/FSMC_CD/ADC3_IN7)
PF10: U1.22(PF10/FSMC_INTR/ADC3_IN8)
PF11: U1.49(PF11/DCMI_D12)
PF12: U1.50(PF12/FSMC_A6)
PF13: U1.53(PF13/FSMC_A7)
PG4: U1.89(PG4/FSMC_A14)
PG5: U1.90(PG5/FSMC_A15)
PG6: U1.91(PG6/FSMC_INT2)
PG7: U1.92(PG7/FSMC_INT3/U6_CK)
PG8: U1.93(PG8/U6_RTS/ETH_PPS_OUT)
PG9: U1.124(PG9/FSMC_NE2/FSMC_NCE3/U6_RX)
PG10: U1.125(PG10/FSMC_NCE4_1/FSMC_NE3)
PG11: U1.126(PG11/FSMC_NCE4_2/ETH_MII_TX_EN/ETH_RMII_TX_EN)
PG12: U1.127(PG12/FSMC_NE4/U6_RTS)
PG13: U1.128(PG13/FSMC_A24/U6_CTS/ETH_MII_TXD0/ETH_RMII_TXD0)
PG14: U1.129(PG14/FSMC_A25/U6_TX/ETH_MII_TXD1/ETH_RMII_TXD1)
PG15: U1.132(PG15/U6_CTS/DCMI_D13)
RS232_1_RX: P5.2 U4.14(T1OUT)
RS232_1_TX: P5.3 U4.13(R1IN)
RS232_2_RX: P6.2 U4.7(T2OUT)
RS232_2_TX: P6.3 U4.8(R2IN)
RS232_3_RX: P7.2 U5.14(T1OUT)
RS232_3_TX: P7.3 U5.13(R1IN)
RST: C7.1 C34.1 K1.1 R14.2 U1.25(NRST) U2.18(PB0ADC12_IN8TIM3_CH3)  [also labelled STLINK_NRST]
STLINK_RX: P1.2 U2.13(PA3USART2_RXADC12_IN3TIM2_CH4)
STLINK_TX: P1.1 U2.12(PA2USART2_TXADC12_IN2TIM2_CH3)
STp_AIN: R1.1 R2.2 U2.10(PA0_WKUPUSART2_CTSADC12_IN0TIM2_CH1_ETR)
STp_LED: R20.2 U2.30(PA9USART1_TXTIM1_CH2)
STp_NRST: C5.2 P3.4 R4.1 U2.7(NRST)
STp_SWCLK: P3.2 U2.37(PA14JTCKSWCLK)
STp_SWDIO: P3.3 U2.34(PA13JTMSSWDIO)
STp_USBDN: R12.1 USB1.A7(D-) USB1.B7(D-)
STp_USBDP: R9.1 R13.1 USB1.A6(D+) USB1.B6(D+)
STp_USBN: R12.2 U2.32(PA11USART1_CTSCAN_RXTIM1_CH4USBDM)
STp_USBP: R13.2 U2.33(PA12USART1_RTSCAN_TXTIM1_ETRUSBDP)
STp_USBRENU: R3.2 U2.38(PA15JTDI)
VBAT: C6.1 D1.2 D2.2 U1.6(VBAT)
NetBAT1_1: BAT1.1(VCC) D2.1
NetBEEP1_2: BEEP1.2(G) Q2.3(C)
NetC1_2: C1.2 U2.5(PD0-OSC_IN) Y2.3(OSC2)
NetC2_1: C2.1 U2.6(PD1-OSC_OUT) Y2.1(OSC1)
NetC8_2: C8.2 U1.71(Vcap_1)
NetC9_2: C9.2 U1.106(Vcap_2)
NetC10_2: C10.2 C11.2 C14.2 R22.1 U1.32(Vref+) U1.33(VDDA)
NetC12_1: C12.1 R19.2 U1.23(PH0-OSC_IN) Y3.3(OSC2)
NetC13_2: C13.2 R19.1 U1.24(PH1-OSC_OUT) Y3.1(OSC1)
NetC16_2: C16.2 U4.2(V+)
NetC17_2: C17.2 U4.6(V-)
NetC18_2: C18.2 U5.2(V+)
NetC19_2: C19.2 U5.6(V-)
NetC21_1: C21.1 U4.3(C1-)
NetC21_2: C21.2 U4.1(C1+)
NetC22_1: C22.1 U4.5(C2-)
NetC22_2: C22.2 U4.4(C2+)
NetC23_1: C23.1 U5.3(C1-)
NetC23_2: C23.2 U5.1(C1+)
NetC24_1: C24.1 U5.5(C2-)
NetC24_2: C24.2 U5.4(C2+)
NetC27_2: C27.2 C30.2 D3.2 R32.2 U6.5(IN)
NetC33_1: C33.1 U6.1(BST)
NetC33_2: C33.2 D4.2 L1.2 U6.6(SW)
NetC34_2: C34.2 U7.13(DTR#)
NetC39_1: C39.1 R38.1 R47.2 U6.3(FB)
NetC41_1: C41.1 U7.4(V3)
NetC55_2: C55.2 OLED1.27(VCOMH)
NetC58_2: C58.2 OLED1.28(VCC)
NetC59_1: C59.1 OLED1.3(C2N)
NetC59_2: C59.2 OLED1.2(C2P)
NetC60_1: C60.1 OLED1.5(C1N)
NetC60_2: C60.2 OLED1.4(C1P)
NetD3_1: D3.1 K2.2(NC)
NetK2_1: K2.1(COMMON) P4.2
NetLED1_2: LED1.2(K) R20.1
NetLED2_2: LED2.2(K) R21.1
NetLED3_2: LED3.2(K) R29.1
NetLED4_2: LED4.2(K) R30.1
NetLED5_1: LED5.1(A) R36.1
NetLED6_1: LED6.1(A) R37.1
NetLED7_1: LED7.1(A) R39.1
NetLED8_1: LED8.1(A) R40.1
NetLED9_1: LED9.1(A) R41.1
NetLED10_1: LED10.1(A) R42.1
NetLED11_1: LED11.1(A) R43.1
NetLED12_1: LED12.1(A) R44.1
NetLED13_1: LED13.1(A) R45.1
NetLED14_1: LED14.1(A) R46.1
NetOLED1_20: OLED1.20(D2) R58.2
NetOLED1_26: OLED1.26(IREF) R57.2
NetP2_3: P2.3 R15.2
NetP2_4: P2.4 R23.1
NetP8_1: P8.1 R59.2 U10.7(CANH)
NetP8_2: P8.2 R59.1 U10.6(CANL)
NetQ1_1: Q1.1(B) R3.1 R5.2 R6.1
NetQ1_2: Q1.2(E) R9.2
NetQ2_1: Q2.1(B) R27.1
NetQ2_2: Q2.2(E) R28.1
NetR7_2: R7.2 U2.2(PC13-TAMPER-RTC)
NetR8_2: R8.2 U2.3(PC14-OSC32_IN)
NetR10_2: R10.2 USB1.A5(CC1)
NetR11_1: R11.1 USB1.B5(CC2)
NetR16_1: R16.1 U2.44(BOOT0)
NetR17_2: R17.2 U2.25(PB12SPI2_NSSI2C2_SMBAUSART3_CKTIM1_BKIN)
NetR18_2: R18.2 U2.39(PB3JTDO)
NetR24_2: R24.2 USB2.A5(CC1)
NetR25_1: R25.1 U3.1(RST)
NetR26_1: R26.1 U3.3(EN)
NetR31_1: R31.1 USB2.B5(CC2)
NetR32_1: R32.1 U6.4(EN)
NetR33_1: R33.1 U3.12(GPIO0)
NetR34_1: R34.1 U3.11(GPIO2)
NetR35_1: R35.1 U3.10(GPIO15)
NetR64_2: R64.2 U11.22(OE#)
NetR67_2: R67.2 U14.22(OE#)
NetR70_1: R70.1 U15.22(OE#)
NetR75_1: R75.1 U11.2(DIR)
NetR76_1: R76.1 R77.2 U12.6(REFIN)
NetR78_1: R78.1 R79.2 U13.6(REFIN)
NetR80_2: R80.2 U14.2(DIR)
NetR81_2: R81.2 U15.2(DIR)

Not connected (* = marked no-connect by the designer): K2 3(NO); OLED1 7(NC(VBREF)); P5 1 4 6 7 8 9; P6 1 4 6 7 8 9; P7 1 4 6 7 8 9; SD_CARD1 10(CD) 11(GND) 12(WP); U1 143(PDR_ON); U2 4(PC15-OSC32_OUT) 11(PA1USART2_RTSADC12_IN1TIM2_CH2) 14(PA4SPI1_NSSUSART2_CKADC12_IN4) 16(PA6SPI1_MISOADC12_IN6TIM3_CH1) 17(PA7SPI1_MOSIADC12_IN7TIM3_CH2) 19(PB1ADC12_IN9TIM3_CH4) 21(PB10I2C2_SCLUSART3_TX) 22(PB11I2C2_SDAUSART3_RX-) 28(PB15SPI2_MOSITIM1_CH3N) 29(PA8USART1_CKTIM1_CH1MCO) 31(PA10USART1_RXTIM1_CH3) 40(PB4NJTRST) 41(PB5I2C1_SMBA) 42(PB6I2C1_SCLTIM4_CH1) 43(PB7I2C1_SDATIM4_CH2) 45(PB8TIM4_CH3) 46(PB9TIM4_CH4); U3 2(ADC) 4(GPIO16) 5(GPIO14) 6(GPIO12) 7(GPIO13) 13(GPIO4) 14(GPIO5) 17(CS0) 18(MISO) 19(GPIO9) 20(GPIO10) 21(MOSI) 22(SCLK); U5 7(T2OUT) 8(R2IN) 9(R2OUT) 10(T2IN); U7 7(XI)* 8(XO)* 9(CTS#)* 10(DSR#)* 11(RI#)* 12(DCD#)* 14(RTS#)* 15(R232)*; U10 5(Vref); U11 9(A7) 10(A8) 14(B8) 15(B7); USB1 A2(TX1+) A3(TX1-) A8(SBU1) A10(RX2-) A11(RX2+) B2(TX2+) B3(TX2-) B8(SBU2) B10(RX1-) B11(RX1+); USB2 A2(TX1+) A3(TX1-) A8(SBU1) A10(RX2-) A11(RX2+) B2(TX2+) B3(TX2-) B8(SBU2) B10(RX1-) B11(RX1+)

## Notes on the sheet
- 5V->3.3V
- 用于烧录STLINK的固件，仅使用一次，临时飞线
- 选择与WIFI模块或者与STLINK通讯
- DC POWER SUPPLY
- BOOT功能表：
- UART1 - TypeC/烧录
  UART2 - COM2
  UART3 - COM3
  UART6 - COM6
  UART4 - WIFI/STlink
- 主控
- Title
- Size:
- Date:
- File:
- A1
- Number:
- Time:
- Revision:
- Sheet
- of

## Library data of the parts
BAT1 = BAT
C1-C33 C35-C43 C45-C60 = C
C34 = C: （可去）
C44 C61 C62 = CAP
D1-D4 = D
F1 = Fuse 2: Fuse; Published: 8-Jun-2000; LatestRevisionDate: 17-Jul-2002; LatestRevisionNote: Re-released for DXP Platform.; PackageReference: PIN-W2/E2.8; Publisher: Altium Limited; PackageDescription: Thru-Hole; 2 Leads
L1 = L
LED1-LED14 = LED: Typical RED, GREEN, YELLOW, AMBER GaAs LED; Published: 8-Jun-2000; LatestRevisionDate: 17-Jul-2002; LatestRevisionNote: Re-released for DXP Platform.; PackageDocument: Feb-2002; PackageReference: 3.2X1.6X1.1; Publisher: Altium Limited
OLED1 = OLED-12864: 显示屏
P1 P2 = Header 3X2: Header, 3-Pin, Dual row; LatestRevisionDate: 17-Jul-2002; LatestRevisionNote: Re-released for DXP Platform.; Publisher: Altium Limited
P3 = Header 5: Header, 5-Pin; LatestRevisionDate: 17-Jul-2002; LatestRevisionNote: Re-released for DXP Platform.; Publisher: Altium Limited
P4 = Header 2: LatestRevisionDate: 17-Jul-2002; LatestRevisionNote: Re-released for DXP Platform.; Publisher: Altium Limited
P5-P7 = DB9母头
P8 = KF142V-2P: BOM_Manufacturer: Cixi Kefa Elec; Contributor: LCSC; BOM_Supplier: LCSC; BOM_Supplier Part: C475134; BOM_Manufacturer Part: KF142V-5.08-2P; BOM_JLCPCB Part Class: Extended Part; spicePre: C; spiceSymbolName: KF142V-5.08-2P
P9 = KF8P
P10-P16 = KF142V-8P
Q1 Q2 = NPN: 8050/BCW846/BCW847
R1-R89 = R
U2 = STM32F103CBT6: BOM_Manufacturer: STMicroelectronics; SMT Type: Basic; timeStamp: 1458840421; BOM_Supplier: LCSC; BOM_Manufacturer Part: STM32F103CBT6; BOM_LCSC Assembly: Yes; image: //image.lceda.cn/szlcsc/C8304.jpg; BOM_Supplier Part: C8304; spicePre: U; BOM_JLCPCB Part Class: Extended Part; spiceSymbolName: STM32F103CBT6
U3 = ESP-12F: BOM_Manufacturer: Ai-Thinker; BOM_Supplier: LCSC; BOM_Manufacturer Part: ESP-12F(ESP8266MOD); BOM_Supplier Part: C82891; BOM_JLCPCB Part Class: Extended Part; spicePre: U; spiceSymbolName: ESP-12F(ESP8266MOD)
U4 U5 = MAX3232
U6 = MP2359: DC DC Step Down IC
U7 = CH340G
U8 U9 = AMS1117
U10 = SN65HVD230D
U11 U14 U15 = SN74LVC4245APWR: BOM_Manufacturer: TI; BOM_Supplier: LCSC; BOM_Manufacturer Part: SN74LVC4245APWR; BOM_Supplier Part: C7859; BOM_JLCPCB Part Class: Basic Part; spicePre: U; spiceSymbolName: SN74LVC4245APWR
U12 U13 = TLC5615IDR: BOM_Manufacturer: Texas Instruments; Contributor: LCSC; BOM_Supplier: LCSC; BOM_Supplier Part: C527509; BOM_Manufacturer Part: TLC5615IDR; BOM_JLCPCB Part Class: Extended Part; spicePre: U; spiceSymbolName: TLC5615IDR
USB1 USB2 = USB-Type-C-TOP
Y1 = XTAL: Crystal Oscillator; Published: 8-Jun-2000; LatestRevisionDate: 17-Jul-2002; LatestRevisionNote: Re-released for DXP Platform.; Publisher: Altium Limited
Y2 Y3 = Y: BOM_Manufacturer: YXC; BOM_Manufacturer Part: X322516MLB4SI; nameAlias: Frequency; BOM_Supplier: LCSC; BOM_Supplier Part: C13738; BOM_JLCPCB Part Class: Basic Part; spicePre: X; spiceSymbolName: X322516MLB4SI